# EasyEDA Pro project ProPrj_Xenon KB_2025-12-28.epro, schematic Schematic1_2
Board Name: Board1; Create Date: 2025-12-16; Page Name: P1; Project Name: Xenon KB; Schematic Name: Schematic1; Update Date: 2025-12-19; Company: EasyEDA.com; Page Size: A4; Version: V1.0
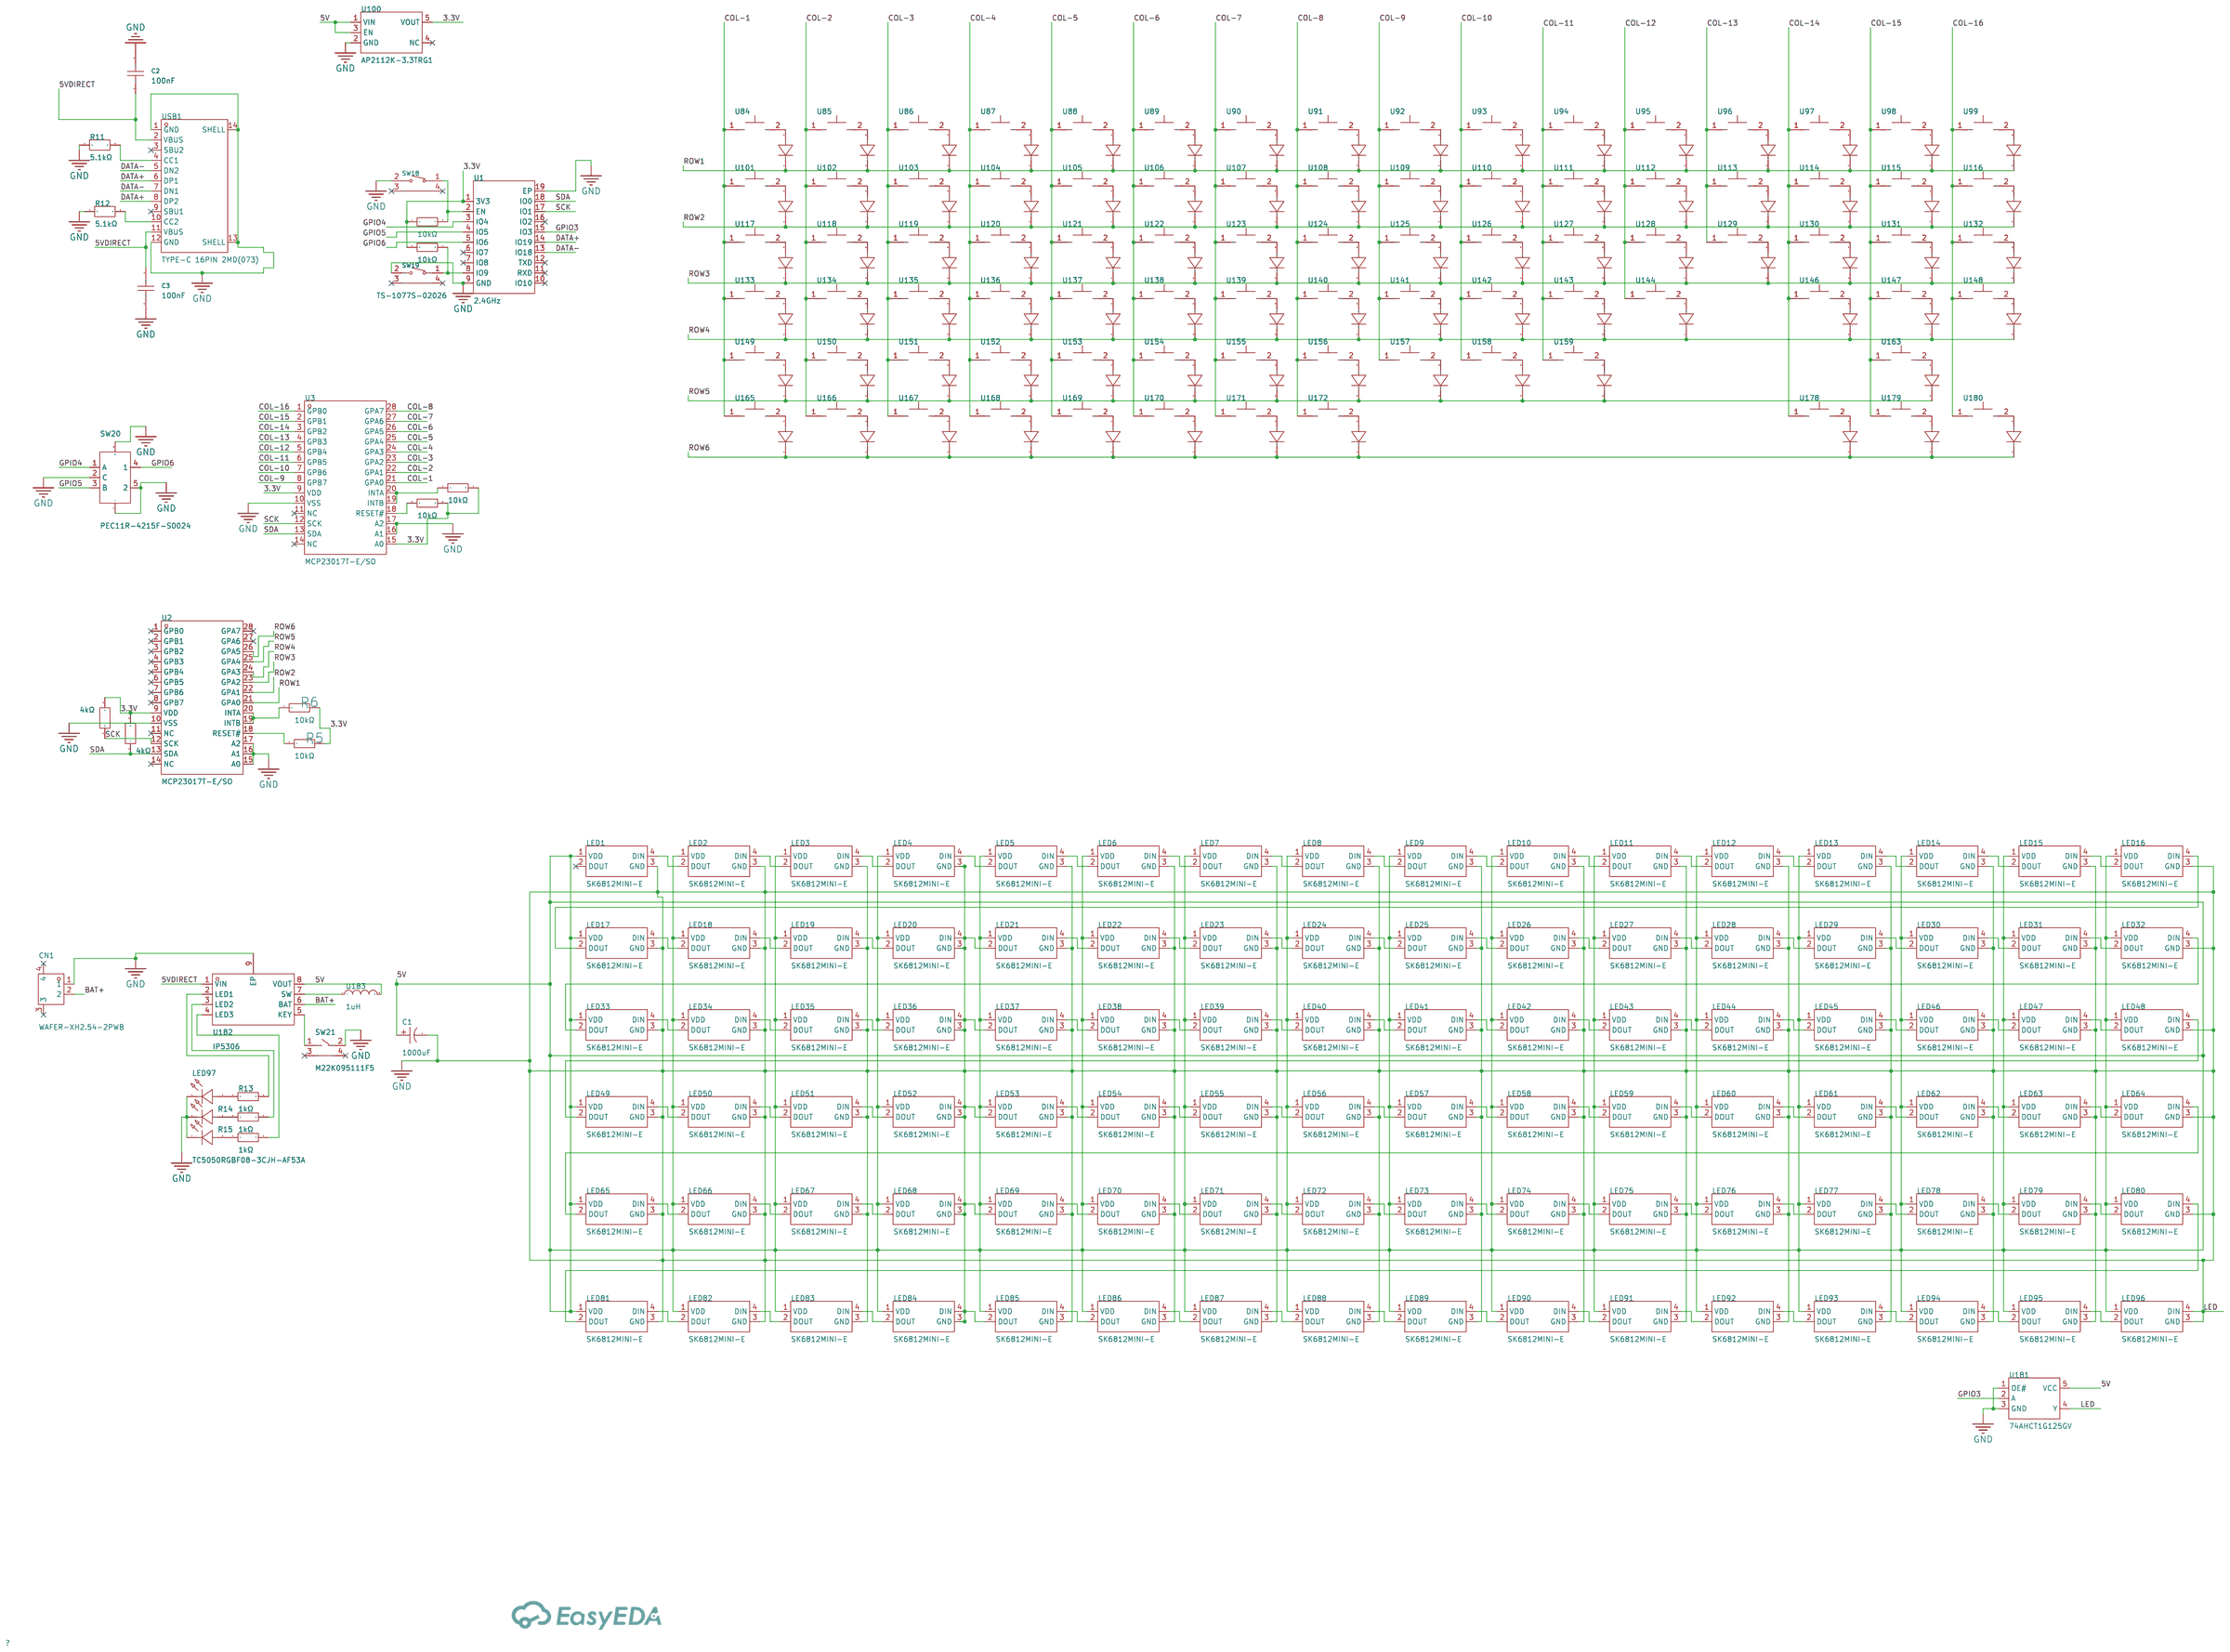
[diagram p5: schematic sheet]

## Parts
C1  1000uF  [CAP-TH_BD8.0-P3.50-D0.5-FD]
C2  100nF  [C0603]
C3  100nF  [C0603]
CN1  WAFER-XH2.54-2PWB  [CONN-SMD_2P-P2.54-XH2.54-WT]
D2  1N4148W  [SOD-123_L2.7-W1.7-LS3.8-RD]
D3  1N4148W  [SOD-123_L2.7-W1.7-LS3.8-RD]
D4  1N4148W  [SOD-123_L2.7-W1.7-LS3.8-RD]
D5  1N4148W  [SOD-123_L2.7-W1.7-LS3.8-RD]
D6  1N4148W  [SOD-123_L2.7-W1.7-LS3.8-RD]
D7  1N4148W  [SOD-123_L2.7-W1.7-LS3.8-RD]
D8  1N4148W  [SOD-123_L2.7-W1.7-LS3.8-RD]
D9  1N4148W  [SOD-123_L2.7-W1.7-LS3.8-RD]
D10  1N4148W  [SOD-123_L2.7-W1.7-LS3.8-RD]
D11  1N4148W  [SOD-123_L2.7-W1.7-LS3.8-RD]
D12  1N4148W  [SOD-123_L2.7-W1.7-LS3.8-RD]
D13  1N4148W  [SOD-123_L2.7-W1.7-LS3.8-RD]
D14  1N4148W  [SOD-123_L2.7-W1.7-LS3.8-RD]
D15  1N4148W  [SOD-123_L2.7-W1.7-LS3.8-RD]
D16  1N4148W  [SOD-123_L2.7-W1.7-LS3.8-RD]
D17  1N4148W  [SOD-123_L2.7-W1.7-LS3.8-RD]
D18  1N4148W  [SOD-123_L2.7-W1.7-LS3.8-RD]
D19  1N4148W  [SOD-123_L2.7-W1.7-LS3.8-RD]
D20  1N4148W  [SOD-123_L2.7-W1.7-LS3.8-RD]
D21  1N4148W  [SOD-123_L2.7-W1.7-LS3.8-RD]
D22  1N4148W  [SOD-123_L2.7-W1.7-LS3.8-RD]
D23  1N4148W  [SOD-123_L2.7-W1.7-LS3.8-RD]
D24  1N4148W  [SOD-123_L2.7-W1.7-LS3.8-RD]
D25  1N4148W  [SOD-123_L2.7-W1.7-LS3.8-RD]
D26  1N4148W  [SOD-123_L2.7-W1.7-LS3.8-RD]
D27  1N4148W  [SOD-123_L2.7-W1.7-LS3.8-RD]
D28  1N4148W  [SOD-123_L2.7-W1.7-LS3.8-RD]
D29  1N4148W  [SOD-123_L2.7-W1.7-LS3.8-RD]
D30  1N4148W  [SOD-123_L2.7-W1.7-LS3.8-RD]
D31  1N4148W  [SOD-123_L2.7-W1.7-LS3.8-RD]
D32  1N4148W  [SOD-123_L2.7-W1.7-LS3.8-RD]
D33  1N4148W  [SOD-123_L2.7-W1.7-LS3.8-RD]
D34  1N4148W  [SOD-123_L2.7-W1.7-LS3.8-RD]
D35  1N4148W  [SOD-123_L2.7-W1.7-LS3.8-RD]
D36  1N4148W  [SOD-123_L2.7-W1.7-LS3.8-RD]
D37  1N4148W  [SOD-123_L2.7-W1.7-LS3.8-RD]
D38  1N4148W  [SOD-123_L2.7-W1.7-LS3.8-RD]
D39  1N4148W  [SOD-123_L2.7-W1.7-LS3.8-RD]
D40  1N4148W  [SOD-123_L2.7-W1.7-LS3.8-RD]
D41  1N4148W  [SOD-123_L2.7-W1.7-LS3.8-RD]
D42  1N4148W  [SOD-123_L2.7-W1.7-LS3.8-RD]
D43  1N4148W  [SOD-123_L2.7-W1.7-LS3.8-RD]
D44  1N4148W  [SOD-123_L2.7-W1.7-LS3.8-RD]
D45  1N4148W  [SOD-123_L2.7-W1.7-LS3.8-RD]
D46  1N4148W  [SOD-123_L2.7-W1.7-LS3.8-RD]
D47  1N4148W  [SOD-123_L2.7-W1.7-LS3.8-RD]
D48  1N4148W  [SOD-123_L2.7-W1.7-LS3.8-RD]
D49  1N4148W  [SOD-123_L2.7-W1.7-LS3.8-RD]
D50  1N4148W  [SOD-123_L2.7-W1.7-LS3.8-RD]
D51  1N4148W  [SOD-123_L2.7-W1.7-LS3.8-RD]
D52  1N4148W  [SOD-123_L2.7-W1.7-LS3.8-RD]
D53  1N4148W  [SOD-123_L2.7-W1.7-LS3.8-RD]
D54  1N4148W  [SOD-123_L2.7-W1.7-LS3.8-RD]
D55  1N4148W  [SOD-123_L2.7-W1.7-LS3.8-RD]
D56  1N4148W  [SOD-123_L2.7-W1.7-LS3.8-RD]
D57  1N4148W  [SOD-123_L2.7-W1.7-LS3.8-RD]
D58  1N4148W  [SOD-123_L2.7-W1.7-LS3.8-RD]
D59  1N4148W  [SOD-123_L2.7-W1.7-LS3.8-RD]
D60  1N4148W  [SOD-123_L2.7-W1.7-LS3.8-RD]
D61  1N4148W  [SOD-123_L2.7-W1.7-LS3.8-RD]
D63  1N4148W  [SOD-123_L2.7-W1.7-LS3.8-RD]
D64  1N4148W  [SOD-123_L2.7-W1.7-LS3.8-RD]
D65  1N4148W  [SOD-123_L2.7-W1.7-LS3.8-RD]
D66  1N4148W  [SOD-123_L2.7-W1.7-LS3.8-RD]
D67  1N4148W  [SOD-123_L2.7-W1.7-LS3.8-RD]
D68  1N4148W  [SOD-123_L2.7-W1.7-LS3.8-RD]
D69  1N4148W  [SOD-123_L2.7-W1.7-LS3.8-RD]
D70  1N4148W  [SOD-123_L2.7-W1.7-LS3.8-RD]
D71  1N4148W  [SOD-123_L2.7-W1.7-LS3.8-RD]
D72  1N4148W  [SOD-123_L2.7-W1.7-LS3.8-RD]
D73  1N4148W  [SOD-123_L2.7-W1.7-LS3.8-RD]
D74  1N4148W  [SOD-123_L2.7-W1.7-LS3.8-RD]
D75  1N4148W  [SOD-123_L2.7-W1.7-LS3.8-RD]
D76  1N4148W  [SOD-123_L2.7-W1.7-LS3.8-RD]
D80  1N4148W  [SOD-123_L2.7-W1.7-LS3.8-RD]
D82  1N4148W  [SOD-123_L2.7-W1.7-LS3.8-RD]
D83  1N4148W  [SOD-123_L2.7-W1.7-LS3.8-RD]
D84  1N4148W  [SOD-123_L2.7-W1.7-LS3.8-RD]
D85  1N4148W  [SOD-123_L2.7-W1.7-LS3.8-RD]
D86  1N4148W  [SOD-123_L2.7-W1.7-LS3.8-RD]
D87  1N4148W  [SOD-123_L2.7-W1.7-LS3.8-RD]
D88  1N4148W  [SOD-123_L2.7-W1.7-LS3.8-RD]
D89  1N4148W  [SOD-123_L2.7-W1.7-LS3.8-RD]
D95  1N4148W  [SOD-123_L2.7-W1.7-LS3.8-RD]
D96  1N4148W  [SOD-123_L2.7-W1.7-LS3.8-RD]
D97  1N4148W  [SOD-123_L2.7-W1.7-LS3.8-RD]
LED1  SK6812MINI-E  [LED-SMD_L3.2-W2.8-LS5.9_SK6812MINI-E]
LED2  SK6812MINI-E  [LED-SMD_L3.2-W2.8-LS5.9_SK6812MINI-E]
LED3  SK6812MINI-E  [LED-SMD_L3.2-W2.8-LS5.9_SK6812MINI-E]
LED4  SK6812MINI-E  [LED-SMD_L3.2-W2.8-LS5.9_SK6812MINI-E]
LED5  SK6812MINI-E  [LED-SMD_L3.2-W2.8-LS5.9_SK6812MINI-E]
LED6  SK6812MINI-E  [LED-SMD_L3.2-W2.8-LS5.9_SK6812MINI-E]
LED7  SK6812MINI-E  [LED-SMD_L3.2-W2.8-LS5.9_SK6812MINI-E]
LED8  SK6812MINI-E  [LED-SMD_L3.2-W2.8-LS5.9_SK6812MINI-E]
LED9  SK6812MINI-E  [LED-SMD_L3.2-W2.8-LS5.9_SK6812MINI-E]
LED10  SK6812MINI-E  [LED-SMD_L3.2-W2.8-LS5.9_SK6812MINI-E]
LED11  SK6812MINI-E  [LED-SMD_L3.2-W2.8-LS5.9_SK6812MINI-E]
LED12  SK6812MINI-E  [LED-SMD_L3.2-W2.8-LS5.9_SK6812MINI-E]
LED13  SK6812MINI-E  [LED-SMD_L3.2-W2.8-LS5.9_SK6812MINI-E]
LED14  SK6812MINI-E  [LED-SMD_L3.2-W2.8-LS5.9_SK6812MINI-E]
LED15  SK6812MINI-E  [LED-SMD_L3.2-W2.8-LS5.9_SK6812MINI-E]
LED16  SK6812MINI-E  [LED-SMD_L3.2-W2.8-LS5.9_SK6812MINI-E]
LED17  SK6812MINI-E  [LED-SMD_L3.2-W2.8-LS5.9_SK6812MINI-E]
LED18  SK6812MINI-E  [LED-SMD_L3.2-W2.8-LS5.9_SK6812MINI-E]
LED19  SK6812MINI-E  [LED-SMD_L3.2-W2.8-LS5.9_SK6812MINI-E]
LED20  SK6812MINI-E  [LED-SMD_L3.2-W2.8-LS5.9_SK6812MINI-E]
LED21  SK6812MINI-E  [LED-SMD_L3.2-W2.8-LS5.9_SK6812MINI-E]
LED22  SK6812MINI-E  [LED-SMD_L3.2-W2.8-LS5.9_SK6812MINI-E]
LED23  SK6812MINI-E  [LED-SMD_L3.2-W2.8-LS5.9_SK6812MINI-E]
LED24  SK6812MINI-E  [LED-SMD_L3.2-W2.8-LS5.9_SK6812MINI-E]
LED25  SK6812MINI-E  [LED-SMD_L3.2-W2.8-LS5.9_SK6812MINI-E]
LED26  SK6812MINI-E  [LED-SMD_L3.2-W2.8-LS5.9_SK6812MINI-E]
LED27  SK6812MINI-E  [LED-SMD_L3.2-W2.8-LS5.9_SK6812MINI-E]
LED28  SK6812MINI-E  [LED-SMD_L3.2-W2.8-LS5.9_SK6812MINI-E]
LED29  SK6812MINI-E  [LED-SMD_L3.2-W2.8-LS5.9_SK6812MINI-E]
LED30  SK6812MINI-E  [LED-SMD_L3.2-W2.8-LS5.9_SK6812MINI-E]
LED31  SK6812MINI-E  [LED-SMD_L3.2-W2.8-LS5.9_SK6812MINI-E]
LED32  SK6812MINI-E  [LED-SMD_L3.2-W2.8-LS5.9_SK6812MINI-E]
LED33  SK6812MINI-E  [LED-SMD_L3.2-W2.8-LS5.9_SK6812MINI-E]
LED34  SK6812MINI-E  [LED-SMD_L3.2-W2.8-LS5.9_SK6812MINI-E]
LED35  SK6812MINI-E  [LED-SMD_L3.2-W2.8-LS5.9_SK6812MINI-E]
LED36  SK6812MINI-E  [LED-SMD_L3.2-W2.8-LS5.9_SK6812MINI-E]
LED37  SK6812MINI-E  [LED-SMD_L3.2-W2.8-LS5.9_SK6812MINI-E]
LED38  SK6812MINI-E  [LED-SMD_L3.2-W2.8-LS5.9_SK6812MINI-E]
LED39  SK6812MINI-E  [LED-SMD_L3.2-W2.8-LS5.9_SK6812MINI-E]
LED40  SK6812MINI-E  [LED-SMD_L3.2-W2.8-LS5.9_SK6812MINI-E]
LED41  SK6812MINI-E  [LED-SMD_L3.2-W2.8-LS5.9_SK6812MINI-E]
LED42  SK6812MINI-E  [LED-SMD_L3.2-W2.8-LS5.9_SK6812MINI-E]
LED43  SK6812MINI-E  [LED-SMD_L3.2-W2.8-LS5.9_SK6812MINI-E]
LED44  SK6812MINI-E  [LED-SMD_L3.2-W2.8-LS5.9_SK6812MINI-E]
LED45  SK6812MINI-E  [LED-SMD_L3.2-W2.8-LS5.9_SK6812MINI-E]
LED46  SK6812MINI-E  [LED-SMD_L3.2-W2.8-LS5.9_SK6812MINI-E]
LED47  SK6812MINI-E  [LED-SMD_L3.2-W2.8-LS5.9_SK6812MINI-E]
LED48  SK6812MINI-E  [LED-SMD_L3.2-W2.8-LS5.9_SK6812MINI-E]
LED49  SK6812MINI-E  [LED-SMD_L3.2-W2.8-LS5.9_SK6812MINI-E]
LED50  SK6812MINI-E  [LED-SMD_L3.2-W2.8-LS5.9_SK6812MINI-E]
LED51  SK6812MINI-E  [LED-SMD_L3.2-W2.8-LS5.9_SK6812MINI-E]
LED52  SK6812MINI-E  [LED-SMD_L3.2-W2.8-LS5.9_SK6812MINI-E]
LED53  SK6812MINI-E  [LED-SMD_L3.2-W2.8-LS5.9_SK6812MINI-E]
LED54  SK6812MINI-E  [LED-SMD_L3.2-W2.8-LS5.9_SK6812MINI-E]
LED55  SK6812MINI-E  [LED-SMD_L3.2-W2.8-LS5.9_SK6812MINI-E]
LED56  SK6812MINI-E  [LED-SMD_L3.2-W2.8-LS5.9_SK6812MINI-E]
LED57  SK6812MINI-E  [LED-SMD_L3.2-W2.8-LS5.9_SK6812MINI-E]
LED58  SK6812MINI-E  [LED-SMD_L3.2-W2.8-LS5.9_SK6812MINI-E]
LED59  SK6812MINI-E  [LED-SMD_L3.2-W2.8-LS5.9_SK6812MINI-E]
LED60  SK6812MINI-E  [LED-SMD_L3.2-W2.8-LS5.9_SK6812MINI-E]
LED61  SK6812MINI-E  [LED-SMD_L3.2-W2.8-LS5.9_SK6812MINI-E]
LED62  SK6812MINI-E  [LED-SMD_L3.2-W2.8-LS5.9_SK6812MINI-E]
LED63  SK6812MINI-E  [LED-SMD_L3.2-W2.8-LS5.9_SK6812MINI-E]
LED64  SK6812MINI-E  [LED-SMD_L3.2-W2.8-LS5.9_SK6812MINI-E]
LED65  SK6812MINI-E  [LED-SMD_L3.2-W2.8-LS5.9_SK6812MINI-E]
LED66  SK6812MINI-E  [LED-SMD_L3.2-W2.8-LS5.9_SK6812MINI-E]
LED67  SK6812MINI-E  [LED-SMD_L3.2-W2.8-LS5.9_SK6812MINI-E]
LED68  SK6812MINI-E  [LED-SMD_L3.2-W2.8-LS5.9_SK6812MINI-E]
LED69  SK6812MINI-E  [LED-SMD_L3.2-W2.8-LS5.9_SK6812MINI-E]
LED70  SK6812MINI-E  [LED-SMD_L3.2-W2.8-LS5.9_SK6812MINI-E]
LED71  SK6812MINI-E  [LED-SMD_L3.2-W2.8-LS5.9_SK6812MINI-E]
LED72  SK6812MINI-E  [LED-SMD_L3.2-W2.8-LS5.9_SK6812MINI-E]
LED73  SK6812MINI-E  [LED-SMD_L3.2-W2.8-LS5.9_SK6812MINI-E]
LED74  SK6812MINI-E  [LED-SMD_L3.2-W2.8-LS5.9_SK6812MINI-E]
LED75  SK6812MINI-E  [LED-SMD_L3.2-W2.8-LS5.9_SK6812MINI-E]
LED76  SK6812MINI-E  [LED-SMD_L3.2-W2.8-LS5.9_SK6812MINI-E]
LED77  SK6812MINI-E  [LED-SMD_L3.2-W2.8-LS5.9_SK6812MINI-E]
LED78  SK6812MINI-E  [LED-SMD_L3.2-W2.8-LS5.9_SK6812MINI-E]
LED79  SK6812MINI-E  [LED-SMD_L3.2-W2.8-LS5.9_SK6812MINI-E]
LED80  SK6812MINI-E  [LED-SMD_L3.2-W2.8-LS5.9_SK6812MINI-E]
LED81  SK6812MINI-E  [LED-SMD_L3.2-W2.8-LS5.9_SK6812MINI-E]
LED82  SK6812MINI-E  [LED-SMD_L3.2-W2.8-LS5.9_SK6812MINI-E]
LED83  SK6812MINI-E  [LED-SMD_L3.2-W2.8-LS5.9_SK6812MINI-E]
LED84  SK6812MINI-E  [LED-SMD_L3.2-W2.8-LS5.9_SK6812MINI-E]
LED85  SK6812MINI-E  [LED-SMD_L3.2-W2.8-LS5.9_SK6812MINI-E]
LED86  SK6812MINI-E  [LED-SMD_L3.2-W2.8-LS5.9_SK6812MINI-E]
LED87  SK6812MINI-E  [LED-SMD_L3.2-W2.8-LS5.9_SK6812MINI-E]
LED88  SK6812MINI-E  [LED-SMD_L3.2-W2.8-LS5.9_SK6812MINI-E]
LED89  SK6812MINI-E  [LED-SMD_L3.2-W2.8-LS5.9_SK6812MINI-E]
LED90  SK6812MINI-E  [LED-SMD_L3.2-W2.8-LS5.9_SK6812MINI-E]
LED91  SK6812MINI-E  [LED-SMD_L3.2-W2.8-LS5.9_SK6812MINI-E]
LED92  SK6812MINI-E  [LED-SMD_L3.2-W2.8-LS5.9_SK6812MINI-E]
LED93  SK6812MINI-E  [LED-SMD_L3.2-W2.8-LS5.9_SK6812MINI-E]
LED94  SK6812MINI-E  [LED-SMD_L3.2-W2.8-LS5.9_SK6812MINI-E]
LED95  SK6812MINI-E  [LED-SMD_L3.2-W2.8-LS5.9_SK6812MINI-E]
LED96  SK6812MINI-E  [LED-SMD_L3.2-W2.8-LS5.9_SK6812MINI-E]
LED97  TC5050RGBF08-3CJH-AF53A  [LED-SMD_6P-L5.0-W5.0-TL_TC5050RGBF08]
R3  10kΩ  [R0603]
R4  10kΩ  [R0603]
R5  10kΩ  [R0603]
R6  10kΩ  [R0603]
R7  10kΩ  [R0603]
R8  4kΩ  [R0603]
R9  4kΩ  [R0603]
R10  10kΩ  [R0603]
R11  5.1kΩ  [R0603]
R12  5.1kΩ  [R0603]
R13  1kΩ  [R0603]
R14  1kΩ  [R0603]
R15  1kΩ  [R0603]
SW18  TS-1077S-02026  [SW-SMD_L3.1-W3.1-P2.20-LS4.0]
SW19  TS-1077S-02026  [SW-SMD_L3.1-W3.1-P2.20-LS4.0]
SW20  PEC11R-4215F-S0024  [SW-TH_5P-L12.5-W13.4-P2.50-LS14.5]
SW21  M22K095111F5  [SW-TH_4P-L7.5-W9.5]
U1  2.4GHz  [BULETM-SMD_ESPRESSIF_ESP32-C3-WROOM-02-N4-4MB]
U2  MCP23017T-E/SO  [SOIC-28_L17.9-W7.5-P1.27-LS10.3-BL]
U3  MCP23017T-E/SO  [SOIC-28_L17.9-W7.5-P1.27-LS10.3-BL]
U84  CPG151101D01  [SW-TH_CPG151101D9X]
U85  CPG151101D01  [SW-TH_CPG151101D9X]
U86  CPG151101D01  [SW-TH_CPG151101D9X]
U87  CPG151101D01  [SW-TH_CPG151101D9X]
U88  CPG151101D01  [SW-TH_CPG151101D9X]
U89  CPG151101D01  [SW-TH_CPG151101D9X]
U90  CPG151101D01  [SW-TH_CPG151101D9X]
U91  CPG151101D01  [SW-TH_CPG151101D9X]
U92  CPG151101D01  [SW-TH_CPG151101D9X]
U93  CPG151101D01  [SW-TH_CPG151101D9X]
U94  CPG151101D01  [SW-TH_CPG151101D9X]
U95  CPG151101D01  [SW-TH_CPG151101D9X]
U96  CPG151101D01  [SW-TH_CPG151101D9X]
U97  CPG151101D01  [SW-TH_CPG151101D9X]
U98  CPG151101D01  [SW-TH_CPG151101D9X]
U99  CPG151101D01  [SW-TH_CPG151101D9X]
U100  AP2112K-3.3TRG1  [SOT-23-5_L2.9-W1.6-P0.95-LS2.8-BR]
U101  CPG151101D01  [SW-TH_CPG151101D9X]
U102  CPG151101D01  [SW-TH_CPG151101D9X]
U103  CPG151101D01  [SW-TH_CPG151101D9X]
U104  CPG151101D01  [SW-TH_CPG151101D9X]
U105  CPG151101D01  [SW-TH_CPG151101D9X]
U106  CPG151101D01  [SW-TH_CPG151101D9X]
U107  CPG151101D01  [SW-TH_CPG151101D9X]
U108  CPG151101D01  [SW-TH_CPG151101D9X]
U109  CPG151101D01  [SW-TH_CPG151101D9X]
U110  CPG151101D01  [SW-TH_CPG151101D9X]
U111  CPG151101D01  [SW-TH_CPG151101D9X]
U112  CPG151101D01  [SW-TH_CPG151101D9X]
U113  CPG151101D01  [SW-TH_CPG151101D9X]
U114  CPG151101D01  [SW-TH_CPG151101D9X]
U115  CPG151101D01  [SW-TH_CPG151101D9X]
U116  CPG151101D01  [SW-TH_CPG151101D9X]
U117  CPG151101D01  [SW-TH_CPG151101D9X]
U118  CPG151101D01  [SW-TH_CPG151101D9X]
U119  CPG151101D01  [SW-TH_CPG151101D9X]
U120  CPG151101D01  [SW-TH_CPG151101D9X]
U121  CPG151101D01  [SW-TH_CPG151101D9X]
U122  CPG151101D01  [SW-TH_CPG151101D9X]
U123  CPG151101D01  [SW-TH_CPG151101D9X]
U124  CPG151101D01  [SW-TH_CPG151101D9X]
U125  CPG151101D01  [SW-TH_CPG151101D9X]
U126  CPG151101D01  [SW-TH_CPG151101D9X]
U127  CPG151101D01  [SW-TH_CPG151101D9X]
U128  CPG151101D01  [SW-TH_CPG151101D9X]
U129  CPG151101D01  [SW-TH_CPG151101D9X]
U130  CPG151101D01  [SW-TH_CPG151101D9X]
U131  CPG151101D01  [SW-TH_CPG151101D9X]
U132  CPG151101D01  [SW-TH_CPG151101D9X]
U133  CPG151101D01  [SW-TH_CPG151101D9X]
U134  CPG151101D01  [SW-TH_CPG151101D9X]
U135  CPG151101D01  [SW-TH_CPG151101D9X]
U136  CPG151101D01  [SW-TH_CPG151101D9X]
U137  CPG151101D01  [SW-TH_CPG151101D9X]
U138  CPG151101D01  [SW-TH_CPG151101D9X]
U139  CPG151101D01  [SW-TH_CPG151101D9X]
U140  CPG151101D01  [SW-TH_CPG151101D9X]
U141  CPG151101D01  [SW-TH_CPG151101D9X]
U142  CPG151101D01  [SW-TH_CPG151101D9X]
U143  CPG151101D01  [SW-TH_CPG151101D9X]
U144  CPG151101D01  [SW-TH_CPG151101D9X]
U146  CPG151101D01  [SW-TH_CPG151101D9X]
U147  CPG151101D01  [SW-TH_CPG151101D9X]
U148  CPG151101D01  [SW-TH_CPG151101D9X]
U149  CPG151101D01  [SW-TH_CPG151101D9X]
U150  CPG151101D01  [SW-TH_CPG151101D9X]
U151  CPG151101D01  [SW-TH_CPG151101D9X]
U152  CPG151101D01  [SW-TH_CPG151101D9X]
U153  CPG151101D01  [SW-TH_CPG151101D9X]
U154  CPG151101D01  [SW-TH_CPG151101D9X]
U155  CPG151101D01  [SW-TH_CPG151101D9X]
U156  CPG151101D01  [SW-TH_CPG151101D9X]
U157  CPG151101D01  [SW-TH_CPG151101D9X]
U158  CPG151101D01  [SW-TH_CPG151101D9X]
U159  CPG151101D01  [SW-TH_CPG151101D9X]
U163  CPG151101D01  [SW-TH_CPG151101D9X]
U165  CPG151101D01  [SW-TH_CPG151101D9X]
U166  CPG151101D01  [SW-TH_CPG151101D9X]
U167  CPG151101D01  [SW-TH_CPG151101D9X]
U168  CPG151101D01  [SW-TH_CPG151101D9X]
U169  CPG151101D01  [SW-TH_CPG151101D9X]
U170  CPG151101D01  [SW-TH_CPG151101D9X]
U171  CPG151101D01  [SW-TH_CPG151101D9X]
U172  CPG151101D01  [SW-TH_CPG151101D9X]
U178  CPG151101D01  [SW-TH_CPG151101D9X]
U179  CPG151101D01  [SW-TH_CPG151101D9X]
U180  CPG151101D01  [SW-TH_CPG151101D9X]
U181  74AHCT1G125GV  [SOT-23-5_L3.0-W1.7-P0.95-LS2.8-BL]
U182  IP5306  [ESOP-8_L4.9-W3.9-P1.27-LS6.0-BL-EP]
U183  1uH  [L0603]
USB1  TYPE-C 16PIN 2MD(073)  [USB-C-SMD_TYPE-C-6PIN-2MD-073]

## Library data of the parts
C1 = KM108M016F16RR0VH2FP0: Capacitance:1000uF Tolerance:±20% Tolerance:±20% Voltage Rating:16V Ripple Current:- Equivalent Series Resistance(ESR):- Pin Spacing:3.5mm Diameter:8mm Height - Seated (Max):16mm Lifetime:2000hrs@105℃; LCSC Part Name: 1000uF ±20% 16V; Supplier Part: C43832; Manufacturer: Chengx(承兴); Supplier Footprint: 插件,D8xL16mm; JLCPCB Part Class: Extended Part; Datasheet: https://item.szlcsc.com/datasheet/KM108M016F16RR0VH2FP0/44834.html; Supplier: LCSC; Tolerance: ±20%; Voltage Rating: 16V; Pin Spacing: 3.5mm; Diameter: 8mm; Height - Seated (Max): 16mm; Lifetime: 2000hrs@105℃
C2 C3 = CL10B104KB8NNNC: Capacitance:100nF Tolerance:±10% Tolerance:±10% Voltage Rating:50V Temperature Coefficient:X7R; LCSC Part Name: 100nF ±10% 50V; Supplier Part: C1591; Manufacturer: SAMSUNG(三星); Supplier Footprint: 0603; JLCPCB Part Class: Extended Part; Datasheet: https://item.szlcsc.com/datasheet/CL10B104KB8NNNC/1943.html; Supplier: LCSC; Tolerance: ±10%; Voltage Rating: 50V; Temperature Coefficient: X7R
CN1 = WAFER-XH2.54-2PWB: Pins Structure:1x2P Pitch:2.5mm Mounting Type:Surface Mount, Right Angle Reference Series:XH Number of Pins:2P Number of Rows:1 Number of PINs Per Row:2 Row Spacing:- Current Rating:3A Contact Material:Brass Contact Plating:Tin Operating Temperature:-25℃~; LCSC Part Name: 1x2P 间距:2.5mm 卧贴 系列:XH; Supplier Part: C3029476; Manufacturer: XUNPU(讯普); Supplier Footprint: SMD,P=2.5mm,卧贴; JLCPCB Part Class: Extended Part; Datasheet: https://item.szlcsc.com/datasheet/WAFER-XH2.54-2PWB/3561488.html; Supplier: LCSC; Pins Structure: 1x2P; Pitch: 2.5mm; Mounting Type: Surface Mount, Right Angle; Reference Series: XH; Number of Pins: 2P; Number of Rows: 1; Number of PINs Per Row: 2; Current Rating: 3A; Contact Material: Brass; Contact Plating: Tin; Operating Temperature: -25℃~+85℃; Voltage Rating: 250V; Plastic Material: LCP; Supplementary Features: Auxiliary Solder Pin; Color: Beige; Z-Height of the Board: 6.2mm; X-Length of Bottom Edge on Board (Spacing Line): 10mm; Y-Width of Bottom Edge on Board: 7.8mm
D2-D61 D63-D76 D80 D82-D89 D95-D97 = 1N4148W_C51953478: Diode Configuration:1 Independent Voltage - Forward(Vf@If):1.25V@150mA Voltage - DC Reverse(Vr):100V Current - Rectified:150mA Pd - Power Dissipation:300mW Reverse Leakage Current (Ir):1uA@75V Reverse Recovery Time (trr):4ns Operating Junction Temperature; LCSC Part Name: 1N4148W 开关二极管 丝印T4 电流：150mA 耐压：100V; Supplier Part: C51953478; Manufacturer: CCX(晁禾); Supplier Footprint: SOD-123; JLCPCB Part Class: Extended Part; Datasheet: https://item.szlcsc.com/datasheet/1N4148W/54682188.html; Supplier: LCSC; Diode Configuration: 1 Independent; Voltage - Forward(Vf@If): 1.25V@150mA; Voltage - DC Reverse(Vr): 100V; Current - Rectified: 150mA; Pd - Power Dissipation: 300mW; Reverse Leakage Current (Ir): 1uA@75V; Reverse Recovery Time (trr): 4ns; Operating Junction Temperature Range: -55℃~+150℃; Non-Repetitive Peak Forward Surge Current: 2A
LED1-LED96 = SK6812MINI-E_C5149201: Supplier Part: C5149201; Manufacturer: 欧思科光电; Supplier Footprint: SMD; JLCPCB Part Class: Extended Part; Datasheet: https://item.szlcsc.com/datasheet/SK6812MINI-E/5773397.html; Supplier: LCSC
LED97 = TC5050RGBF08-3CJH-AF53A: Operating Temperature:-40℃~+85℃ Operating Temperature:-40℃~+85℃; LCSC Part Name: RGB三色; Supplier Part: C784540; Manufacturer: TCWIN(天成); Supplier Footprint: SMD5050-6P; JLCPCB Part Class: Extended Part; Datasheet: https://item.szlcsc.com/datasheet/TC5050RGBF08-3CJH-AF53A/839886.html; Supplier: LCSC; Operating Temperature: -40℃~+85℃
R3-R7 R10 = 0603WAF1002T5E: Type:Thick Film Resistor Resistance:10kΩ Tolerance:±1% Tolerance:±1% Power(Watts):100mW Voltage-Supply(Max):75V Temperature Coefficient:±100ppm/℃ Temperature Coefficient:±100ppm/℃ Operating Temperature:-55℃~+155℃ Operating Temperature:-55℃~+155℃; LCSC Part Name: 厚膜电阻 10kΩ ±1% 100mW; Supplier Part: C25804; Manufacturer: UNI-ROYAL(厚声); Supplier Footprint: 0603; JLCPCB Part Class: Basic Part; Datasheet: https://item.szlcsc.com/datasheet/0603WAF1002T5E/26547.html; Supplier: LCSC; Type: Thick Film Resistor; Tolerance: ±1%; Power(Watts): 100mW; Voltage-Supply(Max): 75V; Temperature Coefficient: ±100ppm/℃; Operating Temperature: -55℃~+155℃
R8 R9 = ARG03FTC4001N: Type:Thin Film Resistor Resistance:4kΩ Tolerance:±1% Tolerance:±1% Power(Watts):100mW Voltage-Supply(Max):75V Temperature Coefficient:±25ppm/℃ Temperature Coefficient:±25ppm/℃ Operating Temperature:-55℃~+155℃ Operating Temperature:-55℃~+155℃; LCSC Part Name: 薄膜电阻 4kΩ ±1%; Supplier Part: C2984443; Manufacturer: Viking(光颉); Supplier Footprint: 0603; JLCPCB Part Class: Extended Part; Datasheet: https://item.szlcsc.com/datasheet/ARG03FTC4001N/3425978.html; Supplier: LCSC; Type: Thin Film Resistor; Tolerance: ±1%; Power(Watts): 100mW; Voltage-Supply(Max): 75V; Temperature Coefficient: ±25ppm/℃; Operating Temperature: -55℃~+155℃
R11 R12 = FRC0603F5101TS: Type:Thick Film Resistor Resistance:5.1kΩ Tolerance:±1% Tolerance:±1% Power(Watts):100mW Voltage-Supply(Max):75V Temperature Coefficient:±100ppm/℃ Temperature Coefficient:±100ppm/℃ Operating Temperature:-55℃~+155℃ Operating Temperature:-55℃~+155℃; LCSC Part Name: 5.1kΩ ±1% 100mW 厚膜电阻; Supplier Part: C2907044; Manufacturer: FOJAN(富捷); Supplier Footprint: 0603; JLCPCB Part Class: Extended Part; Supplier: LCSC; Type: Thick Film Resistor; Tolerance: ±1%; Power(Watts): 100mW; Voltage-Supply(Max): 75V; Temperature Coefficient: ±100ppm/℃; Operating Temperature: -55℃~+155℃
R13-R15 = 0603WAF1001T5E: Type:Thick Film Resistor Resistance:1kΩ Tolerance:±1% Tolerance:±1% Power(Watts):100mW Voltage-Supply(Max):75V Temperature Coefficient:±100ppm/℃ Temperature Coefficient:±100ppm/℃ Operating Temperature:-55℃~+155℃ Operating Temperature:-55℃~+155℃; LCSC Part Name: 1kΩ ±1% 100mW 厚膜电阻; Supplier Part: C21190; Manufacturer: UNI-ROYAL(厚声); Supplier Footprint: 0603; JLCPCB Part Class: Basic Part; Datasheet: https://item.szlcsc.com/datasheet/0603WAF1001T5E/21904.html; Supplier: LCSC; Type: Thick Film Resistor; Tolerance: ±1%; Power(Watts): 100mW; Voltage-Supply(Max): 75V; Temperature Coefficient: ±100ppm/℃; Operating Temperature: -55℃~+155℃
SW18 SW19 = TS-1077S-02026: Circuit:SPST Actuator Style:Round Button Mounting Style:Brick nogging Switch Length:3.1mm Switch Width:3.1mm Switch Height:2mm Contact Current:50mA Voltage Rating (DC):12V With Lamp:- Mechanical Life:-; LCSC Part Name: 3.1*3.1*2mm 立贴 轻触开关; Supplier Part: C455261; Manufacturer: XUNPU(讯普); Supplier Footprint: SMD,3.1x3.1mm; JLCPCB Part Class: Extended Part; Datasheet: https://atta.szlcsc.com/upload/public/pdf/source/20191118/C455261_9365CD1DCF8C40E2584F85DED241B475.pdf; Supplier: LCSC; Circuit: SPST; Actuator Style: Round Button; Mounting Style: Brick nogging; Switch Length: 3.1mm; Switch Width: 3.1mm; Switch Height: 2mm; Contact Current: 50mA; Voltage Rating (DC): 12V
SW20 = PEC11R-4215F-S0024: LCSC Part Name: 三件套 PEC11R-4215F-S0024（三件套）; Supplier Part: C143790; Manufacturer: BOURNS; Supplier Footprint: 插件; JLCPCB Part Class: Extended Part; Datasheet: https://item.szlcsc.com/datasheet/PEC11R-4215F-S0024/155121.html; Supplier: LCSC
SW21 = M22K095111F5: LCSC Part Name: 6*6*5带支架轻触开关 160gf 盐雾48小时; Supplier Part: C49393702; Manufacturer: SAMZO(三佐); Supplier Footprint: 插件; JLCPCB Part Class: Extended Part; Datasheet: https://item.szlcsc.com/datasheet/M22K095111F5/51913919.html; Supplier: LCSC
U1 = ESP32-C3-WROOM-02-N4_C2934560: Core Processor:ESP32-C3芯片 Support Interface:I2C；GPIO；SPI；JTAG；UART；USB；I2S Frequency:2.4GHz Output Power:20.5dBm Output Power:20.5dBm; LCSC Part Name: ESP32-C3-WROOM-02-N4; Supplier Part: C2934560; Manufacturer: ESPRESSIF(乐鑫); Manufacturer Part: ESP32-C3-WROOM-02-N4; Supplier Footprint: VFQFN-32-EP; JLCPCB Part Class: Extended Part; Datasheet: https://atta.szlcsc.com/upload/public/pdf/source/20220106/F07459EFFE1D7CBA94B4FB8A075146A6.pdf; Supplier: LCSC; Core Processor: ESP32-C3芯片; Support Interface: I2C；GPIO；SPI；JTAG；UART；USB；I2S; Output Power: 20.5dBm
U2 U3 = MCP23017T-E/SO: Interface:I2C Number of I/O:16 Interrupt Output:Interrupt Output Output Type:- Voltage - Supply:1.8V~5.5V Voltage - Supply:1.8V~5.5V Current - Output Low(IOL):8mA Current - Output High(IOH):3mA Clock Frequency:1.7MHz Operating Temperature:-40℃~+125℃ Opera; LCSC Part Name: 带串行接口的16位IO扩展器; Supplier Part: C629440; Manufacturer: MICROCHIP(美国微芯); Supplier Footprint: SOIC-28-300mil; JLCPCB Part Class: Extended Part; Datasheet: https://item.szlcsc.com/datasheet/MCP23017T-E%252FSO/659239.html; Supplier: LCSC; Interface: I2C; Number of I/O: 16; Interrupt Output: Interrupt Output; Voltage - Supply: 1.8V~5.5V; Current - Output Low(IOL): 8mA; Current - Output High(IOH): 3mA; Clock Frequency: 1.7MHz; Operating Temperature: -40℃~+125℃; Number of Supporting Devices: 8; Quiescent Current: 3uA; Output Logic Level - Low: 600mV
U84-U99 U101-U144 U146-U159 U163 U165-U172 U178-U180 = CPG151101D01: Supplier Part: C49234238; Manufacturer: HanElectricity(瀚源); Supplier Footprint: 插件; JLCPCB Part Class: Extended Part; Datasheet: https://item.szlcsc.com/datasheet/CPG151101D01/51650380.html; Supplier: LCSC
U100 = AP2112K-3.3TRG1_C23380830: Output Type:Fixed Voltage - Supply:5.5V Output Voltage:3.3V Output Voltage:3.3V Output Current:600mA Power Supply Rejection Ratio (PSRR):75dB@(1kHz) Voltage Dropout:320mV@(600mA) standby current:10uA Features:Over Temperature Protection Operating Temperat; LCSC Part Name: 集成电路; Supplier Part: C23380830; Manufacturer: TECH PUBLIC(台舟); Supplier Footprint: SOT-23-5; JLCPCB Part Class: Extended Part; Datasheet: https://item.szlcsc.com/datasheet/AP2112K-3.3TRG1/25111500.html; Supplier: LCSC; Output Type: Fixed; Voltage - Supply: 5.5V; Output Voltage: 3.3V; Output Current: 600mA; Power Supply Rejection Ratio (PSRR): 75dB@(1kHz); Voltage Dropout: 320mV@(600mA); standby current: 10uA; Features: Over Temperature Protection; Operating Temperature: -40℃~+85℃@(Ta); Output Configuration: Positive; Number of Outputs: 1
U181 = 74AHCT1G125GV: Supplier Part: C52140417; Manufacturer: MDD(辰达半导体); Supplier Footprint: SOT-23-5L; JLCPCB Part Class: Extended Part; Datasheet: https://item.szlcsc.com/datasheet/74AHCT1G125GV/54938146.html; Supplier: LCSC
U182 = IP5306: The Chip Type:Charging IC；Protection IC Voltage - Supply:4.65V~5.5V Voltage - Supply:4.65V~5.5V Charge Current - Max:2.1A Charging Saturation Voltage:4.2V End-Off Voltage:3V Type of Battery:Lithium Battery Number of Cells:1 Number of Cells:1 Operating Tem; LCSC Part Name: 集成2.1A充电器和2.1A放电器的全集成移动电源系统级芯片; Supplier Part: C181692; Manufacturer: INJOINIC(英集芯); Supplier Footprint: ESOP-8; JLCPCB Part Class: Extended Part; Datasheet: https://item.szlcsc.com/datasheet/IP5306/193089.html; Supplier: LCSC; The Chip Type: Charging IC；Protection IC; Voltage - Supply: 4.65V~5.5V; Charge Current - Max: 2.1A; Charging Saturation Voltage: 4.2V; End-Off Voltage: 3V; Type of Battery: Lithium Battery; Number of Cells: 1; Operating Temperature: 0℃~+70℃; Supply Current (Iq): 100uA; Interface: I2C
U183 = YL160808-1R0K: Inductance:1uH Tolerance:±10% Tolerance:±10% Current Rating:25mA Current - Saturation (Isat):- DC Resistance(DCR):600mΩ Q @ Frequency:35@10MHz Frequency - Self Resonant:75MHz Ratings:-; LCSC Part Name: 1uH ±10%; Supplier Part: C2839970; Manufacturer: YJYCOIN(益嘉源); Supplier Footprint: 0603; JLCPCB Part Class: Extended Part; Datasheet: https://item.szlcsc.com/datasheet/YL160808-1R0K/3017530.html; Supplier: LCSC; Tolerance: ±10%; Current Rating: 25mA; DC Resistance(DCR): 600mΩ; Q @ Frequency: 35@10MHz; Frequency - Self Resonant: 75MHz
USB1 = TYPE-C 16PIN 2MD(073): Connector Type:Type-C Protocol Standard:- Gender:Female Mounting Type:Surface Mount, Right Angle Number of Contacts:16P Number of Ports:1 Current Rating-Power:3A Voltage Rating:5V Connect-Disconnect Life:5,000 Cycles Supplementary Features:- Center Height; LCSC Part Name: Type-C 母 卧贴; Supplier Part: C; Manufacturer: SHOU HAN(首韩); Supplier Footprint: SMD; JLCPCB Part Class: Extended Part; Datasheet: https://item.szlcsc.com/datasheet/TYPE-C%252016PIN%25202MD(073)/2901843.html; Supplier: LCSC; Connector Type: Type-C; Gender: Female; Mounting Type: Surface Mount, Right Angle; Number of Contacts: 16P; Number of Ports: 1; Current Rating-Power: 3A; Voltage Rating: 5V; Connect-Disconnect Life: 5,000 Cycles; Detection color: Black; Operating Temperature: -25℃~+85℃

## Nets
3.3V: R3.1 R4.2 R5.2 R6.2 R7.2 R8.2 R9.2 R10.1 U1.1(3V3) U2.9(VDD) U3.9(VDD) U3.15(A0) U100.5(VOUT)
5V: C1.1 LED1.1(VDD) LED2.1(VDD) LED3.1(VDD) LED4.1(VDD) LED5.1(VDD) LED6.1(VDD) LED7.1(VDD) LED8.1(VDD) LED9.1(VDD) LED10.1(VDD) LED11.1(VDD) LED12.1(VDD) LED13.1(VDD) LED14.1(VDD) LED15.1(VDD) LED16.1(VDD) LED17.1(VDD) LED18.1(VDD) LED19.1(VDD) LED20.1(VDD) LED21.1(VDD) LED22.1(VDD) LED23.1(VDD) LED24.1(VDD) LED25.1(VDD) LED26.1(VDD) LED27.1(VDD) LED28.1(VDD) LED29.1(VDD) LED30.1(VDD) LED31.1(VDD) LED32.1(VDD) LED33.1(VDD) LED34.1(VDD) LED35.1(VDD) LED36.1(VDD) LED37.1(VDD) LED38.1(VDD) LED39.1(VDD) LED40.1(VDD) LED41.1(VDD) LED42.1(VDD) LED43.1(VDD) LED44.1(VDD) LED45.1(VDD) LED46.1(VDD) LED47.1(VDD) LED48.1(VDD) LED49.1(VDD) LED50.1(VDD) LED51.1(VDD) LED52.1(VDD) LED53.1(VDD) LED54.1(VDD) LED55.1(VDD) LED56.1(VDD) LED57.1(VDD) LED58.1(VDD) LED59.1(VDD) LED60.1(VDD) LED61.1(VDD) LED62.1(VDD) LED63.1(VDD) LED64.1(VDD) LED65.1(VDD) LED66.1(VDD) LED67.1(VDD) LED68.1(VDD) LED69.1(VDD) LED70.1(VDD) LED71.1(VDD) LED72.1(VDD) LED73.1(VDD) LED74.1(VDD) LED75.1(VDD) LED76.1(VDD) LED77.1(VDD) LED78.1(VDD) LED79.1(VDD) LED80.1(VDD) LED81.1(VDD) LED82.1(VDD) LED83.1(VDD) LED84.1(VDD) LED85.1(VDD) LED86.1(VDD) LED87.1(VDD) LED88.1(VDD) LED89.1(VDD) LED90.1(VDD) LED91.1(VDD) LED92.1(VDD) LED93.1(VDD) LED94.1(VDD) LED95.1(VDD) LED96.1(VDD) U100.1(VIN) U100.3(EN) U181.5(VCC) U182.8(VOUT) U183.2
5VDIRECT: C2.1 C3.1 U182.1(VIN) USB1.2(VBUS) USB1.11(VBUS)
GND: C1.2 C2.2 C3.2 CN1.1 LED1.3(GND) LED2.3(GND) LED3.3(GND) LED4.3(GND) LED5.3(GND) LED6.3(GND) LED7.3(GND) LED8.3(GND) LED9.3(GND) LED10.3(GND) LED11.3(GND) LED12.3(GND) LED13.3(GND) LED14.3(GND) LED15.3(GND) LED16.3(GND) LED17.3(GND) LED18.3(GND) LED19.3(GND) LED20.3(GND) LED20.4(DIN) LED21.2(DOUT) LED21.3(GND) LED22.3(GND) LED23.3(GND) LED24.3(GND) LED25.3(GND) LED26.3(GND) LED27.3(GND) LED28.3(GND) LED29.3(GND) LED30.3(GND) LED31.3(GND) LED32.3(GND) LED33.3(GND) LED34.3(GND) LED35.3(GND) LED36.3(GND) LED36.4(DIN) LED37.2(DOUT) LED37.3(GND) LED38.3(GND) LED39.3(GND) LED40.3(GND) LED41.3(GND) LED42.3(GND) LED43.3(GND) LED44.3(GND) LED45.3(GND) LED46.3(GND) LED47.3(GND) LED48.3(GND) LED49.3(GND) LED50.3(GND) LED51.3(GND) LED52.3(GND) LED52.4(DIN) LED53.2(DOUT) LED53.3(GND) LED54.3(GND) LED55.3(GND) LED56.3(GND) LED57.3(GND) LED58.3(GND) LED59.3(GND) LED60.3(GND) LED61.3(GND) LED62.3(GND) LED63.3(GND) LED64.3(GND) LED65.3(GND) LED66.3(GND) LED67.3(GND) LED68.3(GND) LED68.4(DIN) LED69.2(DOUT) LED69.3(GND) LED70.3(GND) LED71.3(GND) LED72.3(GND) LED73.3(GND) LED74.3(GND) LED75.3(GND) LED76.3(GND) LED77.3(GND) LED78.3(GND) LED79.3(GND) LED80.3(GND) LED81.3(GND) LED82.3(GND) LED83.3(GND) LED84.3(GND) LED84.4(DIN) LED85.2(DOUT) LED85.3(GND) LED86.3(GND) LED87.3(GND) LED88.3(GND) LED89.3(GND) LED90.3(GND) LED91.3(GND) LED92.3(GND) LED93.3(GND) LED94.3(GND) LED95.3(GND) LED96.3(GND) LED97.4(-) LED97.5(-) LED97.6(-) R11.1 R12.1 SW18.2 SW19.2 SW20.2(C) SW20.5(2) SW20.7 SW20.8 SW21.2 U1.9(GND) U1.19(EP) U2.10(VSS) U2.15(A0) U2.16(A1) U2.17(A2) U3.10(VSS) U3.16(A1) U3.17(A2) U100.2(GND) U181.1(OE#) U181.3(GND) U182.9(EP) USB1.1(GND) USB1.12(GND) USB1.13(SHELL) USB1.14(SHELL)
BAT+: CN1.2 U182.6(BAT)
COL-1: U3.21(GPA0) U84.1 U101.1 U117.1 U133.1 U149.1 U165.1
COL-2: U3.22(GPA1) U85.1 U102.1 U118.1 U134.1 U150.1 U166.1
COL-3: U3.23(GPA2) U86.1 U103.1 U119.1 U135.1 U151.1 U167.1
COL-4: U3.24(GPA3) U87.1 U104.1 U120.1 U136.1 U152.1 U168.1
COL-5: U3.25(GPA4) U88.1 U105.1 U121.1 U137.1 U153.1 U169.1
COL-6: U3.26(GPA5) U89.1 U106.1 U122.1 U138.1 U154.1 U170.1
COL-7: U3.27(GPA6) U90.1 U107.1 U123.1 U139.1 U155.1 U171.1
COL-8: U3.28(GPA7) U91.1 U108.1 U124.1 U140.1 U156.1 U172.1
COL-9: U3.8(GPB7) U92.1 U109.1 U125.1 U141.1 U157.1
COL-10: U3.7(GPB6) U93.1 U110.1 U126.1 U142.1 U158.1
COL-11: U3.6(GPB5) U94.1 U111.1 U127.1 U143.1 U159.1
COL-12: U3.5(GPB4) U95.1 U112.1 U128.1 U144.1
COL-13: U3.4(GPB3) U96.1 U113.1 U129.1
COL-14: U3.3(GPB2) U97.1 U114.1 U130.1 U146.1 U178.1
COL-15: U3.2(GPB1) U98.1 U115.1 U131.1 U147.1 U163.1 U179.1
COL-16: U3.1(GPB0) U99.1 U116.1 U132.1 U148.1 U180.1
DATA+: U1.14(IO19) USB1.6(DP1) USB1.8(DP2)
DATA-: U1.13(IO18) USB1.5(DN2) USB1.7(DN1)
GPIO3: U1.15(IO3) U181.2(A)
GPIO4: SW20.1(A) U1.3(IO4)
GPIO5: SW20.3(B) U1.4(IO5)
GPIO6: SW20.4(1) U1.5(IO6)
LED: LED96.4(DIN) U181.4(Y)
ROW1: D2.1(K) D3.1(K) D4.1(K) D5.1(K) D6.1(K) D7.1(K) D8.1(K) D9.1(K) D10.1(K) D11.1(K) D12.1(K) D13.1(K) D14.1(K) D15.1(K) D16.1(K) D17.1(K) U2.21(GPA0)
ROW2: D18.1(K) D19.1(K) D20.1(K) D21.1(K) D22.1(K) D23.1(K) D24.1(K) D25.1(K) D26.1(K) D27.1(K) D28.1(K) D29.1(K) D30.1(K) D31.1(K) D32.1(K) D33.1(K) U2.22(GPA1)
ROW3: D34.1(K) D35.1(K) D36.1(K) D37.1(K) D38.1(K) D39.1(K) D40.1(K) D41.1(K) D42.1(K) D43.1(K) D44.1(K) D45.1(K) D46.1(K) D47.1(K) D48.1(K) D49.1(K) U2.23(GPA2)
ROW4: D50.1(K) D51.1(K) D52.1(K) D53.1(K) D54.1(K) D55.1(K) D56.1(K) D57.1(K) D58.1(K) D59.1(K) D60.1(K) D61.1(K) D63.1(K) D64.1(K) D65.1(K) U2.24(GPA3)
ROW5: D66.1(K) D67.1(K) D68.1(K) D69.1(K) D70.1(K) D71.1(K) D72.1(K) D73.1(K) D74.1(K) D75.1(K) D76.1(K) D80.1(K) U2.25(GPA4)
ROW6: D82.1(K) D83.1(K) D84.1(K) D85.1(K) D86.1(K) D87.1(K) D88.1(K) D89.1(K) D95.1(K) D96.1(K) D97.1(K) U2.26(GPA5)
SCK: R8.1 U1.17(IO1) U2.12(SCK) U3.12(SCK)
SDA: R9.1 U1.18(IO0) U2.13(SDA) U3.13(SDA)
$1N8011: R3.2 SW18.1 U1.2(EN)
$1N8333: R4.1 U3.18(RESET#)
$1N8349: R5.1 U2.18(RESET#)
$1N8397: R6.1 U2.19(INTB) U2.20(INTA)
$1N8451: R7.1 U3.19(INTB) U3.20(INTA)
$1N8545: R10.2 SW19.1 U1.8(IO9)
$1N9001: D2.2(A) U84.2
$1N9049: D3.2(A) U85.2
$1N9090: D4.2(A) U86.2
$1N9209: D5.2(A) U87.2
$1N9211: D6.2(A) U88.2
$1N9213: D7.2(A) U89.2
$1N9332: D8.2(A) U90.2
$1N9334: D9.2(A) U91.2
$1N9336: D10.2(A) U92.2
$1N9455: D11.2(A) U93.2
$1N9457: D12.2(A) U94.2
$1N9459: D13.2(A) U95.2
$1N9578: D14.2(A) U96.2
$1N9580: D15.2(A) U97.2
$1N9582: D16.2(A) U98.2
$1N9701: D17.2(A) U99.2
$1N10807: D20.2(A) U103.2
$1N10809: D19.2(A) U102.2
$1N10811: D18.2(A) U101.2
$1N10813: D32.2(A) U115.2
$1N10815: D33.2(A) U116.2
$1N10817: D31.2(A) U114.2
$1N10819: D30.2(A) U113.2
$1N10821: D29.2(A) U112.2
$1N10823: D26.2(A) U109.2
$1N10825: D28.2(A) U111.2
$1N10827: D27.2(A) U110.2
$1N10829: D25.2(A) U108.2
$1N10831: D24.2(A) U107.2
$1N10833: D23.2(A) U106.2
$1N10835: D22.2(A) U105.2
$1N10837: D21.2(A) U104.2
$1N11943: D36.2(A) U119.2
$1N11945: D35.2(A) U118.2
$1N11947: D34.2(A) U117.2
$1N11949: D48.2(A) U131.2
$1N11951: D49.2(A) U132.2
$1N11953: D47.2(A) U130.2
$1N11955: D46.2(A) U129.2
$1N11957: D45.2(A) U128.2
$1N11959: D42.2(A) U125.2
$1N11961: D44.2(A) U127.2
$1N11963: D43.2(A) U126.2
$1N11965: D41.2(A) U124.2
$1N11967: D40.2(A) U123.2
$1N11969: D39.2(A) U122.2
$1N11971: D38.2(A) U121.2
$1N11973: D37.2(A) U120.2
$1N13079: D52.2(A) U135.2
$1N13081: D51.2(A) U134.2
$1N13083: D50.2(A) U133.2
$1N13085: D64.2(A) U147.2
$1N13087: D65.2(A) U148.2
$1N13093: D61.2(A) U144.2
$1N13095: D58.2(A) U141.2
$1N13097: D60.2(A) U143.2
$1N13099: D59.2(A) U142.2
$1N13101: D57.2(A) U140.2
$1N13103: D56.2(A) U139.2
$1N13105: D55.2(A) U138.2
$1N13107: D54.2(A) U137.2
$1N13109: D53.2(A) U136.2
$1N25115: D82.2(A) U165.2
$1N25117: D97.2(A) U180.2
$1N25118: D95.2(A) U178.2
$1N25120: D80.2(A) U163.2
$1N25128: D75.2(A) U158.2
$1N25129: D88.2(A) U171.2
$1N25130: D72.2(A) U155.2
$1N25131: D73.2(A) U156.2
$1N25133: D89.2(A) U172.2
$1N25135: D74.2(A) U157.2
$1N25136: D71.2(A) U154.2
$1N25137: D87.2(A) U170.2
$1N25138: D69.2(A) U152.2
$1N25139: D85.2(A) U168.2
$1N25140: D70.2(A) U153.2
$1N25141: D86.2(A) U169.2
$1N25142: D83.2(A) U166.2
$1N25143: D84.2(A) U167.2
$1N25144: D68.2(A) U151.2
$1N25145: D67.2(A) U150.2
$1N25146: D66.2(A) U149.2
$1N38841: LED95.4(DIN) LED96.2(DOUT)
$1N38850: LED94.4(DIN) LED95.2(DOUT)
$1N38864: LED93.4(DIN) LED94.2(DOUT)
$1N38873: LED92.4(DIN) LED93.2(DOUT)
$1N38883: LED91.4(DIN) LED92.2(DOUT)
$1N38890: LED90.4(DIN) LED91.2(DOUT)
$1N38897: LED88.4(DIN) LED89.2(DOUT)
$1N38907: LED87.4(DIN) LED88.2(DOUT)
$1N38914: LED86.4(DIN) LED87.2(DOUT)
$1N38924: LED85.4(DIN) LED86.2(DOUT)
$1N38942: LED83.4(DIN) LED84.2(DOUT)
$1N38950: LED81.4(DIN) LED82.2(DOUT)
$1N38954: LED82.4(DIN) LED83.2(DOUT)
$1N39162: LED73.4(DIN) LED74.2(DOUT)
$1N39166: LED72.4(DIN) LED73.2(DOUT)
$1N39170: LED71.4(DIN) LED72.2(DOUT)
$1N39174: LED74.4(DIN) LED75.2(DOUT)
$1N39178: LED76.4(DIN) LED77.2(DOUT)
$1N39182: LED75.4(DIN) LED76.2(DOUT)
$1N39186: LED77.4(DIN) LED78.2(DOUT)
$1N39190: LED67.4(DIN) LED68.2(DOUT)
$1N39194: LED66.4(DIN) LED67.2(DOUT)
$1N39198: LED65.4(DIN) LED66.2(DOUT)
$1N39206: LED70.4(DIN) LED71.2(DOUT)
$1N39210: LED69.4(DIN) LED70.2(DOUT)
$1N39214: LED79.4(DIN) LED80.2(DOUT)
$1N39218: LED78.4(DIN) LED79.2(DOUT)
$1N39222: LED57.4(DIN) LED58.2(DOUT)
$1N39226: LED56.4(DIN) LED57.2(DOUT)
$1N39230: LED55.4(DIN) LED56.2(DOUT)
$1N39234: LED58.4(DIN) LED59.2(DOUT)
$1N39238: LED60.4(DIN) LED61.2(DOUT)
$1N39242: LED59.4(DIN) LED60.2(DOUT)
$1N39246: LED61.4(DIN) LED62.2(DOUT)
$1N39250: LED51.4(DIN) LED52.2(DOUT)
$1N39254: LED50.4(DIN) LED51.2(DOUT)
$1N39258: LED49.4(DIN) LED50.2(DOUT)
$1N39266: LED54.4(DIN) LED55.2(DOUT)
$1N39270: LED53.4(DIN) LED54.2(DOUT)
$1N39274: LED63.4(DIN) LED64.2(DOUT)
$1N39278: LED62.4(DIN) LED63.2(DOUT)
$1N39282: LED41.4(DIN) LED42.2(DOUT)
$1N39286: LED40.4(DIN) LED41.2(DOUT)
$1N39290: LED39.4(DIN) LED40.2(DOUT)
$1N39294: LED42.4(DIN) LED43.2(DOUT)
$1N39298: LED44.4(DIN) LED45.2(DOUT)
$1N39302: LED43.4(DIN) LED44.2(DOUT)
$1N39306: LED45.4(DIN) LED46.2(DOUT)
$1N39310: LED35.4(DIN) LED36.2(DOUT)
$1N39314: LED34.4(DIN) LED35.2(DOUT)
$1N39318: LED33.4(DIN) LED34.2(DOUT)
$1N39326: LED38.4(DIN) LED39.2(DOUT)
$1N39330: LED37.4(DIN) LED38.2(DOUT)
$1N39334: LED47.4(DIN) LED48.2(DOUT)
$1N39338: LED46.4(DIN) LED47.2(DOUT)
$1N39342: LED25.4(DIN) LED26.2(DOUT)
$1N39346: LED24.4(DIN) LED25.2(DOUT)
$1N39350: LED23.4(DIN) LED24.2(DOUT)
$1N39354: LED26.4(DIN) LED27.2(DOUT)
$1N39358: LED28.4(DIN) LED29.2(DOUT)
$1N39362: LED27.4(DIN) LED28.2(DOUT)
$1N39366: LED29.4(DIN) LED30.2(DOUT)
$1N39370: LED19.4(DIN) LED20.2(DOUT)
$1N39374: LED18.4(DIN) LED19.2(DOUT)
$1N39378: LED17.4(DIN) LED18.2(DOUT)
$1N39386: LED22.4(DIN) LED23.2(DOUT)
$1N39390: LED21.4(DIN) LED22.2(DOUT)
$1N39394: LED31.4(DIN) LED32.2(DOUT)
$1N39398: LED30.4(DIN) LED31.2(DOUT)
$1N39402: LED9.4(DIN) LED10.2(DOUT)
$1N39406: LED8.4(DIN) LED9.2(DOUT)
$1N39410: LED7.4(DIN) LED8.2(DOUT)
$1N39414: LED10.4(DIN) LED11.2(DOUT)
$1N39418: LED12.4(DIN) LED13.2(DOUT)
$1N39422: LED11.4(DIN) LED12.2(DOUT)
$1N39426: LED13.4(DIN) LED14.2(DOUT)
$1N39430: LED3.4(DIN) LED4.2(DOUT)
$1N39434: LED2.4(DIN) LED3.2(DOUT)
$1N39438: LED1.4(DIN) LED2.2(DOUT)
$1N39442: LED4.4(DIN) LED5.2(DOUT)
$1N39446: LED6.4(DIN) LED7.2(DOUT)
$1N39450: LED5.4(DIN) LED6.2(DOUT)
$1N39454: LED15.4(DIN) LED16.2(DOUT)
$1N39458: LED14.4(DIN) LED15.2(DOUT)
$1N39464: LED80.4(DIN) LED81.2(DOUT)
$1N39475: LED64.4(DIN) LED65.2(DOUT)
$1N39483: LED48.4(DIN) LED49.2(DOUT)
$1N39492: LED32.4(DIN) LED33.2(DOUT)
$1N39500: LED16.4(DIN) LED17.2(DOUT)
$1N43038: LED89.4(DIN) LED90.2(DOUT)
$1N46077: R11.2 USB1.4(CC1)
$1N46131: R12.2 USB1.10(CC2)
$1N47083: SW21.1 U182.5(KEY)
$1N47288: R13.2 U182.2(LED1)
$1N47293: R14.2 U182.3(LED2)
$1N47299: R15.2 U182.4(LED3)
$1N47391: LED97.3(+) R15.1
$1N47411: LED97.2(+) R14.1
$1N47426: LED97.1(+) R13.1
Net-(D63-2): D63.2(A) U146.2
Net-(D76-2): D76.2(A) U159.2
Net-(D96-2): D96.2(A) U179.2
Net-(U182-7): U182.7(SW) U183.1

Not connected (* = marked no-connect by the designer): CN1 3* 4*; LED1 2(DOUT)*; SW18 3* 4*; SW19 3* 4*; SW21 3* 4*; U1 6(IO7)* 7(IO8)* 10(IO10)* 11(RXD)* 12(TXD)* 16(IO2)*; U2 1(GPB0)* 2(GPB1)* 3(GPB2)* 4(GPB3)* 5(GPB4)* 6(GPB5)* 7(GPB6)* 8(GPB7)* 11(NC)* 14(NC)* 27(GPA6)* 28(GPA7)*; U3 11(NC)* 14(NC)*; U100 4(NC)*; USB1 3(SBU2)* 9(SBU1)*
